# EAGLE design Thermometer (EAGLE 5.07)
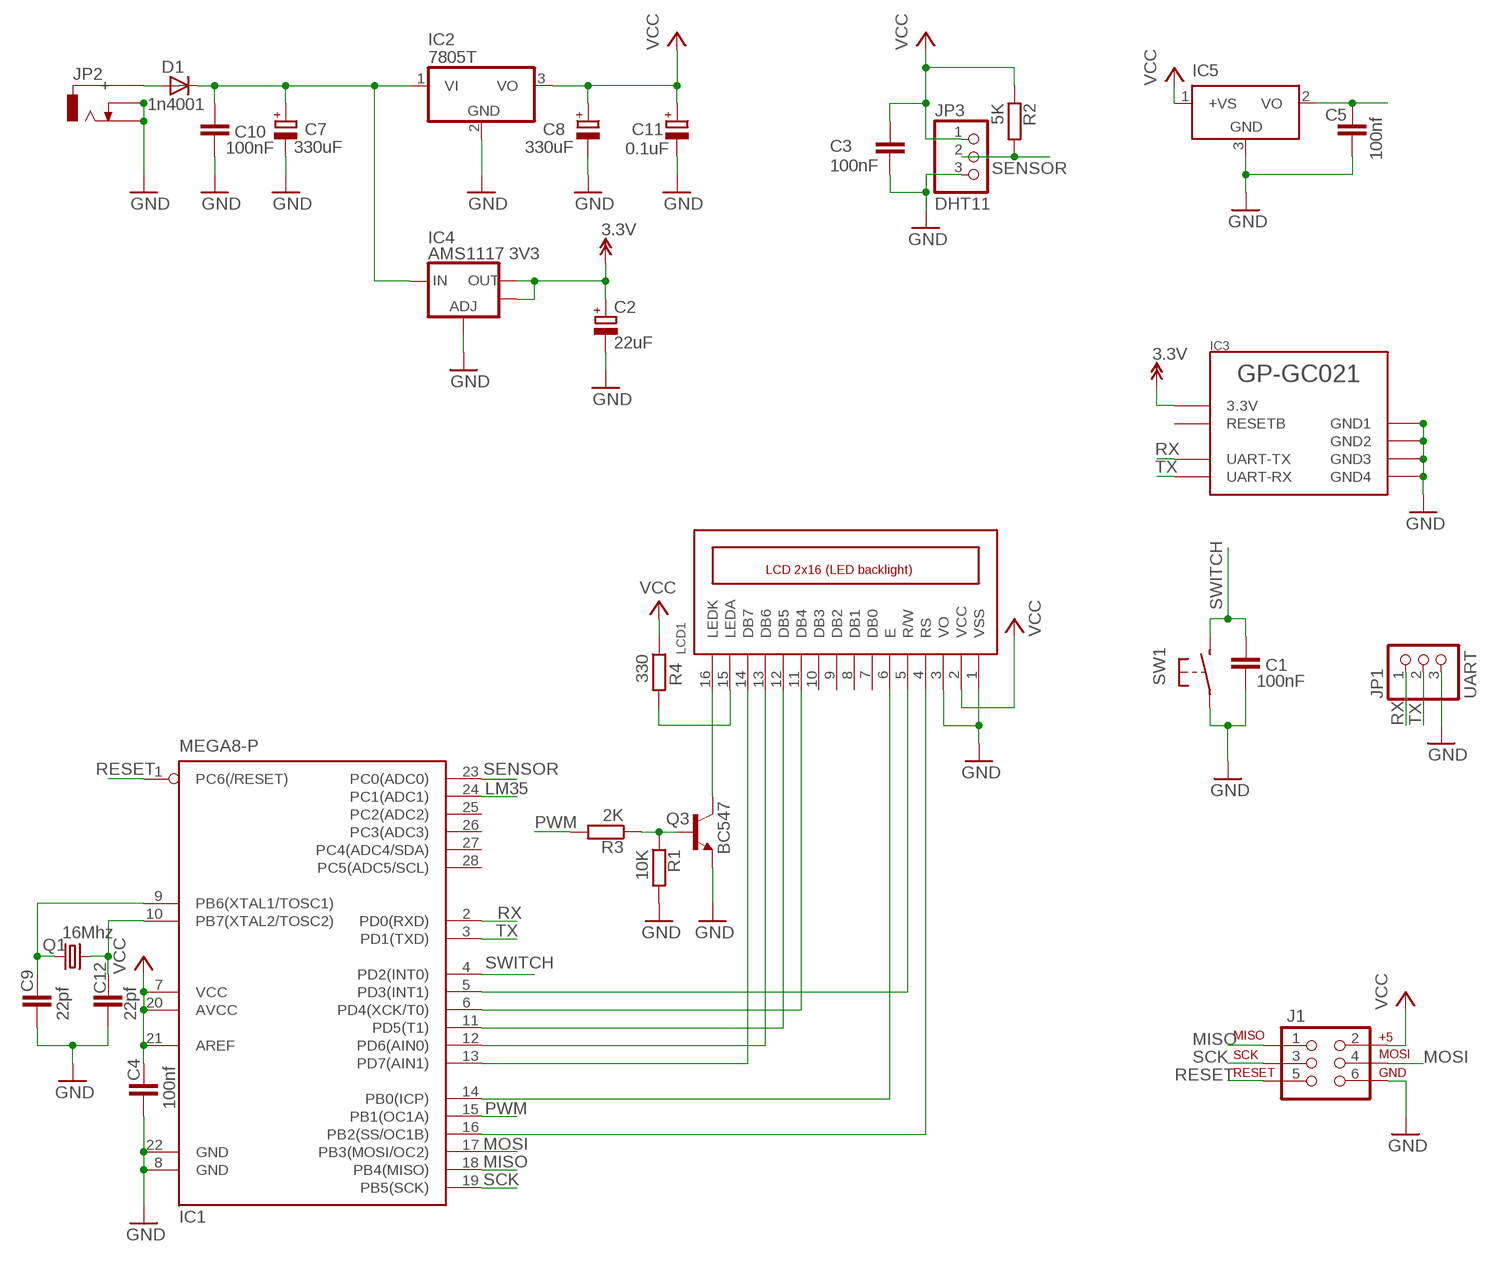
[diagram p0: schematic, sheet 1]

## Parts
C1  100nF  CC-25X72  [C-25X72]
C2  22uF  C-POL5.2  [C-TT2D52]
C3  100nF  CSMD  [CAPACITOR-SMD]
C4  100nf  CSMD  [CAPACITOR-SMD]
C5  100nf  CSMD  [CAPACITOR-SMD]
C7  330uF  C-POL8.2  [C-TT2D82]
C8  330uF  C-POL8.2  [C-TT2D82]
C9  22pf  CSMD  [CAPACITOR-SMD]
C10  100nF  CC-25X72  [C-25X72]
C11  0.1uF  C-POL5.2  [C-TT2D52]
C12  22pf  CSMD  [CAPACITOR-SMD]
D1  1n4001  D1N4005  [D5/25]
IC1  MEGA8-P  ATMEGA-8-P  [DIL-28-3]
IC2  7805T  [TO220H]
IC3  GP-GC021  [GP-GC021]
IC4  AMS1117 3V3  LM1117SOT223  [SOT223]
IC5  LM35T0-92  [TO-92]
J1  AVR-ISP-6/ANGLE  [AVR-ISP-6/ANGLE]
JP1  UART  PINHD-1X3/ANGLE  [1X03/ANGLE]
JP2  POWER-JACK  [POWER-JACK]
JP3  DHT11  PINHD-1X3/ANGLE  [1X03/ANGLE]
LCD1  LCD-HD44780  [HD44780-2X16]
Q1  16Mhz  CRYSTALHC49US  [HC49US]
Q3  BC547  TRANSISTOR_NPNSOT23  [SOT23]
R1  10K  RSMD  [RESISTOR-SMD]
R2  5K  RSMD  [RESISTOR-SMD]
R3  2K  RSMD  [RESISTOR-SMD]
R4  330  RSMD  [RESISTOR-SMD]
SW1  SWITCH  [SWITCH/BUTTON]

## Nets
12V: C2.+ IC3.3.3V IC4.2(OUT) IC4.4(OUT) ; supply symbol labelled 3.3V
GND: C1.2 C2.- C3.2 C4.2 C5.2 C7.- C8.- C9.2 C10.2 C11.- C12.2 IC1.8(GND) IC1.22(GND) IC2.2(GND) IC3.GND2 IC3.GND3 IC3.GND4 IC3.GND(GND1) IC4.1(ADJ) IC5.3(GND1) J1.6 JP1.3 JP2.2(GND1) JP2.3(GND2) JP3.3 LCD1.1(VSS) LCD1.3(VO) Q3.2(E) R1.2 SW1.1(P)
LM35: C5.1 IC1.24(PC1(ADC1)) IC5.2(VO)
MISO: IC1.18(PB4(MISO)) J1.1
MOSI: IC1.17(PB3(MOSI/OC2)) J1.4
N$1: IC1.13(PD7(AIN1)) LCD1.14(DB7)
N$2: IC1.12(PD6(AIN0)) LCD1.13(DB6)
N$3: IC1.11(PD5(T1)) LCD1.12(DB5)
N$4: IC1.6(PD4(XCK/T0)) LCD1.11(DB4)
N$5: C7.+ C10.1 D1.C IC2.1(VI) IC4.3(IN)
N$6: LCD1.15(LEDA) R4.2
N$9: IC1.14(PB0(ICP)) LCD1.6(E)
N$10: IC1.5(PD3(INT1)) LCD1.5(R/W)
N$11: IC1.16(PB2(SS/OC1B)) LCD1.4(RS)
N$12: LCD1.16(LEDK) Q3.3(C)
N$15: D1.A JP2.1(+)
N$16: C12.1 IC1.10(PB7(XTAL2/TOSC2)) Q1.2
N$17: C9.1 IC1.9(PB6(XTAL1/TOSC1)) Q1.1
N$18: Q3.1(B) R1.1 R3.1
PWM: IC1.15(PB1(OC1A)) R3.2
RESET: IC1.1(PC6(/RESET)) J1.5
RX: IC1.2(PD0(RXD)) IC3.UART-TX JP1.1
SCK: IC1.19(PB5(SCK)) J1.3
SENSOR: IC1.23(PC0(ADC0)) JP3.2 R2.2
SWITCH: C1.1 IC1.4(PD2(INT0)) SW1.2(S)
TX: IC1.3(PD1(TXD)) IC3.UART-RX JP1.2
VCC: C3.1 C4.1 C8.+ C11.+ IC1.7(VCC) IC1.20(AVCC) IC1.21(AREF) IC2.3(VO) IC5.1(+VS) J1.2 JP3.1 LCD1.2(VCC) R2.1 R4.1
Unconnected: IC1.25(PC2(ADC2)) IC1.26(PC3(ADC3)) IC1.27(PC4(ADC4/SDA)) IC1.28(PC5(ADC5/SCL)) IC3.RESETB LCD1.7(DB0) LCD1.8(DB1) LCD1.9(DB2) LCD1.10(DB3)

## Library data of the parts
C1 C3-C5 C9 C10 C12 = candrian:C
C2 C7 C8 C11 = candrian:C-POL
D1 = candrian:D
IC1 = candrian:ATMEGA-8-P
IC2 = linear:78*: Positive VOLTAGE REGULATOR Source: http://cache.national.com/ds/LM/LM78L05.pdf http://www.fairchildsemi.com/ds/LM/LM7805.pdf
IC3 = candrian:GP-GC021: Bluetooth Device
IC4 = candrian:LM1117
IC5 = candrian:LM35
J1 = candrian:AVR-ISP-6
JP1 JP3 = pinhead:PINHD-1X3: PIN HEADER
JP2 = candrian:POWER-JACK
LCD1 = candrian:LCD-HD44780
Q1 = candrian:CRYSTAL
Q3 = SparkFun:TRANSISTOR_NPN: Transistor NPN BJT configuration in SOT23 package. MMBT2222 is the common NPN we use. Double check BCE configuration again layout.
R1-R4 = candrian:R
SW1 = candrian:SWITCH

## Board
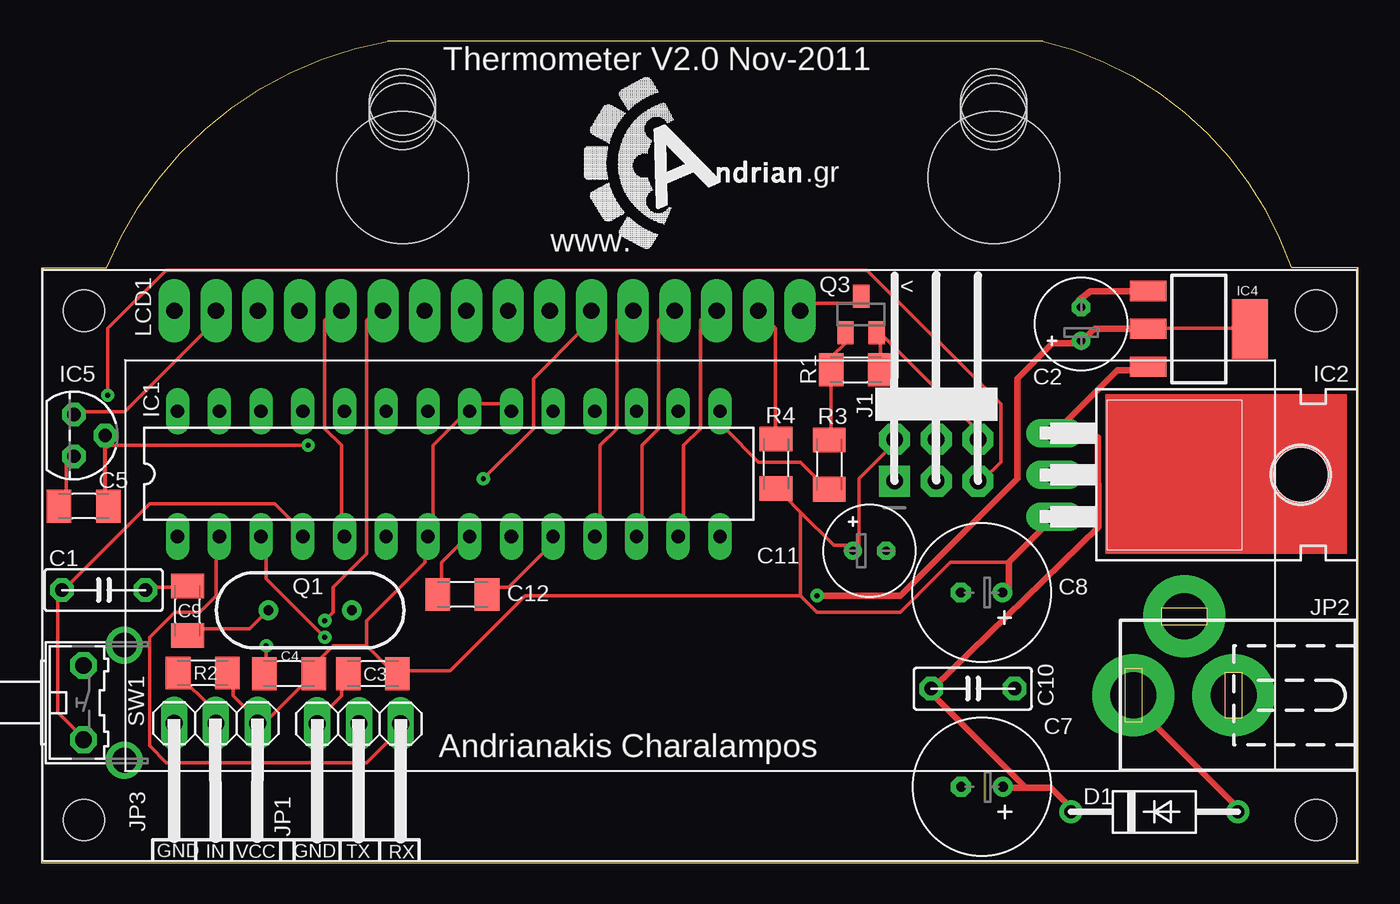
[diagram p1: board, top side]
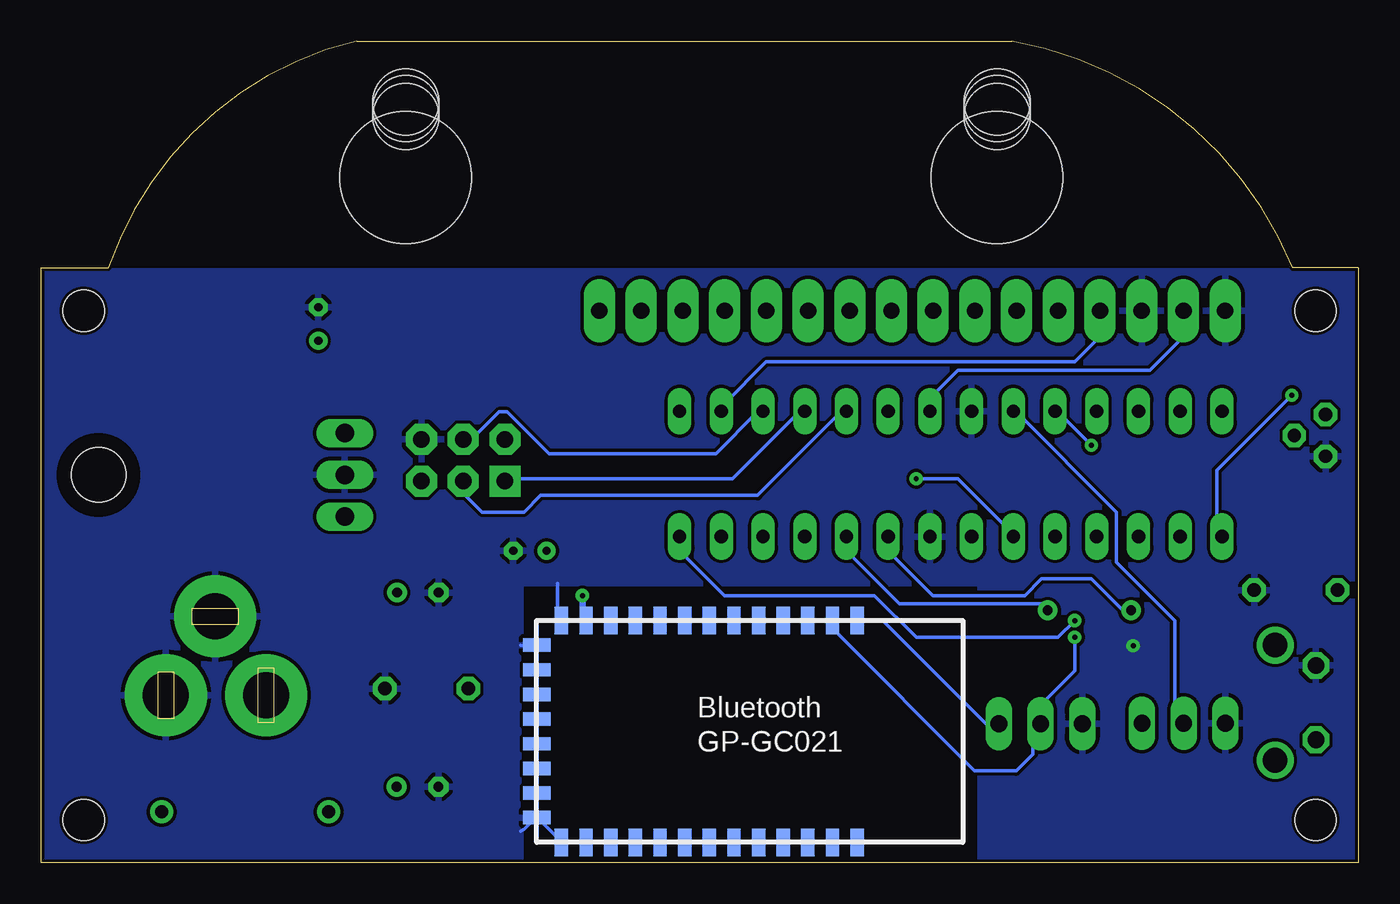
[diagram p2: board, bottom side, seen from below]

Size 80.2 x 50 mm. Coordinates in mm from the lower left corner, seen from the top.
Outline: 0,0 80.2,0 80.2,36.2 76.1,36.2 arc58 61,50 21.1,50 arc58 4,36.2 0,36.2 0,0
Copper layers (1*16): Top 0.035mm / dielectric 1.5mm / Bottom 0.035mm
Design rules "MakePCB": minimum track width 8mil, minimum drill 0.3mm, track to track 0.2mm, track to pad 0.2mm, pad to pad 0.2mm, via to via 0.2mm, smd to smd 0.2mm, copper to edge 8mil, drill to drill 8mil, minimum pad ring 12mil, minimum via ring 10mil, stop-mask expansion 4mil, vias tented up to drill 25mil, thermal gap 10mil
Holes 8 mm at 22,41.7 58,41.7
Holes 4 mm at 22,45.4 22,46.3 22,45.9 58,45.4 58,46.3 58,45.9

### Footprints (pad centres in the part's own frame; a part is rotated, then mirrored left to right if it is on the bottom)
C-25X72 = drill 0.813 octagon: 1 -2.54,0; 2 2.54,0
C-TT2D52 = drill 0.5 round: + -1.016,0 | drill 0.5 octagon: - 1.016,0
CAPACITOR-SMD = smd 1.5 x 2: 1 -1.5,0; 2 1.5,0
C-TT2D82 = drill 0.6 round: + -1.27,0 | drill 0.6 octagon: - 1.27,0
D5/25 = drill 0.8 round: A 5.08,0; C -5.08,0
DIL-28-3 = drill 0.813 long: 1 -15.24,-3.81; 2 -12.7,-3.81; 3 -10.16,-3.81; 4 -7.62,-3.81; 5 -5.08,-3.81; 6 -2.54,-3.81; 7 0,-3.81; 8 2.54,-3.81; 9 5.08,-3.81; 10 7.62,-3.81; 11 10.16,-3.81; 12 12.7,-3.81; 13 15.24,-3.81; 14 17.78,-3.81; 15 17.78,3.81; 16 15.24,3.81; 17 12.7,3.81; 18 10.16,3.81; 19 7.62,3.81; 20 5.08,3.81; 21 2.54,3.81; 22 0,3.81; 23 -2.54,3.81; 24 -5.08,3.81; 25 -7.62,3.81; 26 -10.16,3.81; 27 -12.7,3.81; 28 -15.24,3.81
TO220H = drill 1.118 long: 1 -2.54,-10.16; 2 0,-10.16; 3 2.54,-10.16 | hole 3.302: 0,4.826
GP-GC021 = smd 1.676 x 0.813: 3.3V -6.35,-10.61; GND -6.35,-12.11; GND4 7.15,-12.11; P$3 -6.35,2.89; P$4 -6.35,1.39; P$5 -6.35,-0.11; P$6 -6.35,-1.61; P$7 -6.35,-3.11; P$8 -6.35,-4.61; P$9 -6.35,-6.11; P$11 7.15,-10.61; P$12 7.15,-9.11; P$13 7.15,-7.61; P$16 -6.35,-7.61; P$17 7.15,-6.11; P$27 7.15,5.89; P$28 7.15,4.39; P$29 7.15,2.89; P$30 7.15,1.39; P$31 7.15,-0.11; P$32 7.15,-1.61; P$33 7.15,-3.11; P$34 7.15,-4.61; RESETB -6.35,-9.11; UART-RX -6.35,4.39; UART-TX -6.35,5.89 | smd 0.813 x 1.676: GND2 -4.85,-13.61; GND3 5.65,-13.61; P$300 -3.35,-13.61; P$400 -1.85,-13.61; P$500 -0.35,-13.61; P$600 1.15,-13.61; P$700 2.65,-13.61; P$800 4.15,-13.61
SOT223 = smd 1.219 x 2.235: 1 -2.311,-3.099; 2 0,-3.099; 3 2.311,-3.099 | smd 3.6 x 2.2: 4 0,3.099
TO-92 = drill 0.813 octagon: 1 -1.27,0; 2 0,1.905; 3 1.27,0
AVR-ISP-6/ANGLE = drill 1.016 pad 1.88 square: 1 -2.54,-1.27 | drill 1.016 pad 1.88 octagon: 2 -2.54,1.27; 3 0,-1.27; 4 0,1.27; 5 2.54,-1.27; 6 2.54,1.27
1X03/ANGLE = drill 1.016 long: 1 -2.54,-3.81; 2 0,-3.81; 3 2.54,-3.81
POWER-JACK = drill 2.8 pad 5 round: 1 0,5.64; 2 4.8,2.54; 3 0,-0.46
HD44780-2X16 = drill 1 pad 1.93 long: 1 -31.75,13.97; 2 -29.21,13.97; 3 -26.67,13.97; 4 -24.13,13.97; 5 -21.59,13.97; 6 -19.05,13.97; 7 -16.51,13.97; 8 -13.97,13.97; 9 -11.43,13.97; 10 -8.89,13.97; 11 -6.35,13.97; 12 -3.81,13.97; 13 -1.27,13.97; 14 1.27,13.97; 15 3.81,13.97; 16 6.35,13.97 | hole 2.5: -37.25,13.97; 37.75,13.97; -37.25,-17.03; 37.75,-17.03
HC49US = drill 0.6 round: 1 -2.54,0; 2 2.54,0
SOT23 = smd 1 x 1.4: 1 -0.95,-1.1; 2 0.95,-1.1; 3 0,1.1
RESISTOR-SMD = smd 1.5 x 2: 1 -1.5,0; 2 1.5,0
SWITCH/BUTTON = drill 1.016 octagon: 1 -2.261,-1.245; 2 2.261,-1.245 | drill 1.499 pad 2.159 round: 3 -3.505,1.245; 4 3.505,1.245

### Placement (x,y rotation side)
C1  3.81,16.59 0 top
C2  63.32,32.78 90 top
C3  20.2,11.5 180 top
C4  15.1,11.5 180 top
C5  2.6,21.7 180 top
C7  57.28,4.61 180 top
C8  57.26,16.44 180 top
C9  8.92,15.33 90 top
C10  56.72,10.59 0 top
C11  50.44,18.98 0 top
C12  25.65,16.32 180 top
D1  67.77,3.09 0 top
IC1  23.55,23.66 0 top
IC2  71.87,23.6 270 top
IC3  36.41,8.39 270 bottom
IC4  70.49,32.48 270 top
IC5  2,26 270 top
J1  54.5,24.49 0 top
JP1  19.35,4.65 180 top
JP2  72.14,10.19 90 top
JP3  10.64,4.67 180 top
LCD1  39.86,19.62 0 top
Q1  16.38,15.36 0 top
Q3  49.92,33.36 0 top
R1  49.6,30 0 top
R2  9.85,11.54 180 top
R3  47.98,24.23 270 top
R4  44.75,24.28 90 top
SW1  3.83,9.74 270 top
U$2  [CANDRIAN-LOGO/SMALL]  39.16,41.5 0 top

### Tracks (layer width: path | path; a pad name or v marks a point on that pad's centre or on a via)
12V  (via drill 0.3)
  Top 0.203: 67.11,32.48 IC4.2 67.56,32.51 73.15,32.51 IC4.4
  Top 0.406: v47.24,16.26 52.32,16.26 59.44,23.37 59.44,29.46 61.57,31.6 63.32,31.6 C2.+ 64.16,32.49 67.11,32.48
  Bottom 0.203: IC3.3.3V 47.24,15.24
  Bottom 0.406: 47.24,15.24 v47.24,16.26
GND  (via drill 0.3)
  Top 0.203: 51.46,31.86 57.4,25.91 J1.6 | 51.46,31.86 51.31,32 Q3.2 | C5.2 1.52,21.84 1.52,24.38 IC5.3 | v13.72,13.21 13.72,11.68 C4.2 | C3.2 18.29,11.18 18.29,10.16 16.76,8.64 JP1.3 | C12.2 24.38,16.76 24.38,18.29 25.91,19.81 IC1.8 | C9.2 8.64,16.76 6.6,16.76 C1.2 | 67.45,34.78 IC4.1 | C2.- 63.18,34.24 | 51.46,31.86 50.89,31.86 51.1,31.65 R1.2
  Top 0.406: 67.45,34.78 63.87,34.78 63.18,34.24
  Bottom 0.203: IC3.GND4 48.77,1.52 49.78,2.54 IC3.GND3 50.29,2.54 50.8,2.03 51,1.9 | IC3.GND2 50.29,13.21 50.8,13.21 51,13.24 | IC3.GND 48.77,15.24 48.77,17
  pour Bottom: 0,36 0,0 23,0 23,17 51,17 51,0 80,0 80,36
LM35  (via drill 0.3)
  Top 0.203: 4.06,25.4 v16.26,25.4
  Top 0.254: C5.1 3.9,21.7 IC5.2
  Top 0.406: 4.06,25.4 3.9,25.4 IC5.2
  Bottom 0.203: v16.26,25.4 18.29,27.43 IC1.24
MISO
  Bottom 0.203: IC1.18 34.04,27.43 38.1,23.37 51.82,23.37 J1.1
MOSI
  Bottom 0.203: IC1.17 36.58,27.43 39.12,24.89 49.28,24.89 51.82,27.43 52.32,27.43 54.36,25.4 J1.4
N$1
  Top 0.203: IC1.13 39.12,20.32 39.12,25.4 40.13,26.42 40.13,33.02 40.64,33.53 LCD1.14
N$2
  Top 0.203: IC1.12 36.58,20.32 36.58,25.4 37.59,26.42 37.59,33.02 38.1,33.53 LCD1.13
N$3
  Top 0.203: IC1.11 34.04,20.32 34.04,25.4 35.05,26.42 35.05,33.02 35.56,33.53 LCD1.12
N$4  (via drill 0.3)
  Top 0.203: v26.92,23.37 29.97,26.42 29.97,29.46 33.02,32.51 33.02,33.53 LCD1.11
  Bottom 0.203: v26.92,23.37 24.38,23.37 21.34,20.32 IC1.6
N$5
  Top 0.203: 67.06,29.97 IC4.3 | C10.1 54.36,10.67
  Top 0.406: 67.06,29.97 65.53,29.97 61.98,26.42 IC2.1 61.98,25.91 64.35,25.89 64.38,20.41 54.36,10.67 | 59.94,4.57 61.47,4.57 62.48,3.56 D1.C | 59.94,4.57 58.93,4.57 C7.+ | 59.94,4.57 54.36,10.16 C10.1
N$6
  Top 0.203: R4.2 44.7,25.91 44.7,32.51 43.69,33.53 LCD1.15
N$9  (via drill 0.3)
  Top 0.203: v17.27,14.73 17.78,15.24 17.78,16.76 19.81,18.8 19.81,33.02 20.32,33.53 LCD1.6
  Bottom 0.203: v17.27,14.73 18.29,13.72 26.92,13.72 29.46,16.26 38.61,16.26 41.15,18.8 41.15,19.81 IC1.14
N$10
  Top 0.203: IC1.5 18.29,20.32 18.29,25.4 17.27,26.42 17.27,33.02 17.78,33.53 LCD1.5
N$11
  Bottom 0.203: IC1.16 38.61,27.94 36.07,30.48 17.27,30.48 15.75,32 15.75,33.53 LCD1.4
N$12
  Top 0.203: Q3.3 49.78,34.04 46.23,34.04 LCD1.16
N$15
  Top 0.203: 66.04,10.16 JP2.1
  Top 0.406: 66.04,10.16 72.64,3.56 D1.A
N$16
  Top 0.203: C12.1 27.43,16.76 28.45,16.76 31.5,19.81 IC1.10
  Bottom 0.203: Q1.2 19.3,15.75 27.94,15.75 30.99,18.8 30.99,19.81 IC1.10
N$17
  Top 0.203: C9.1 9.14,14.22 12.7,14.22 13.72,15.24 Q1.1
  Bottom 0.203: IC1.9 28.45,19.81 28.45,18.8 25.91,16.26 20.32,16.26 19.3,17.27 16.26,17.27 14.22,15.24 Q1.1
N$18
  Top 0.203: R3.1 48.1,25.73 R1.1 48.1,30.74 48.16,30.8 48.16,30.82 48.99,31.65 48.99,32.24 Q3.1
PWM
  Top 0.203: R3.2 47.75,22.86 46.23,24.38 43.69,24.38 41.66,26.42 41.66,27.43 IC1.15
RESET  (via drill 0.3)
  Top 0.203: v4.06,28.45 4.06,32.51 7.62,36.07 50.29,36.07 58.42,27.94 58.42,24.38 57.4,23.37 J1.5
  Bottom 0.203: v4.06,28.45 8.64,23.88 8.64,20.32 IC1.1
RX
  Top 0.203: IC1.2 10.67,19.81 10.67,16.26 9.65,15.24 8.13,15.24 6.6,13.72 6.6,7.11 7.62,6.1 19.81,6.1 21.84,8.13 JP1.1
  Bottom 0.203: IC3.UART-TX 30.48,14.73 28.96,14.73 22.35,8.13 JP1.1
SCK
  Bottom 0.203: IC1.19 31.5,27.43 36.58,22.35 49.78,22.35 50.8,21.34 53.34,21.34 54.86,22.86 J1.3
SENSOR
  Top 0.203: R2.2 8.64,11.18 10.16,9.65 10.16,8.64 JP3.2
  Bottom 0.203: IC1.23 20.83,27.43 14.73,21.34 14.73,18.29 11.18,14.73 11.18,9.14 10.67,8.64 JP3.2
SWITCH
  Top 0.203: SW1.2 2.54,7.62 1.02,9.14 1.02,16.26 C1.1 1.52,16.76 6.6,21.84 14.22,21.84 15.75,20.32 IC1.4
TX  (via drill 0.3)
  Top 0.203: v17.27,13.72 13.72,17.27 13.72,19.81 IC1.3
  Bottom 0.203: IC3.UART-RX 32,14.73 32,14.22 23.37,5.59 20.83,5.59 19.81,6.6 19.81,8.13 JP1.2 19.3,8.64 19.3,9.65 17.27,11.68 v17.27,13.72
VCC
  Top 0.203: 61.47,20.83 IC2.3 | 46.23,21.34 48.26,19.3 49.28,19.3 C11.+ 49.78,19.3 49.78,23.37 51.82,25.4 J1.2 | 46.23,21.34 45.21,22.35 R4.1 | 58.93,18.29 55.37,18.29 52.32,15.24 47.24,15.24 46.23,16.26 | 46.23,16.26 46.23,21.34 | IC5.1 2.03,27.43 5.08,27.43 10.16,32.51 10.16,33.53 LCD1.2 | R2.1 11.68,11.18 11.68,10.16 13.21,8.64 JP3.1 13.21,8.13 16.26,11.18 C4.1 16.26,11.68 17.78,13.21 19.81,13.21 | 19.81,13.21 21.34,11.68 C3.1 21.84,11.68 24.89,11.68 29.46,16.26 46.23,16.26 | IC1.20 28.45,27.94 26.42,27.94 IC1.21 25.91,27.43 23.88,25.4 23.88,20.32 IC1.7 23.37,19.81 23.37,18.29 19.81,14.73 19.81,13.21
  Top 0.406: 61.47,20.83 58.93,18.29 58.93,16.76 C8.+
  Bottom 0.203: LCD1.2 10.67,33.53 10.67,32 12.7,29.97 24.38,29.97 26.42,27.94 IC1.21
(copper drawn outside any net)
  shapes: Top area x1

### Text on the board
tNames: Thermometer V2.0 Nov-2011 | < | Andrianakis Charalampos | IN | VCC | GND | TX | RX | GND